# EAGLE design STM32F4Stick (EAGLE 6.6.0)
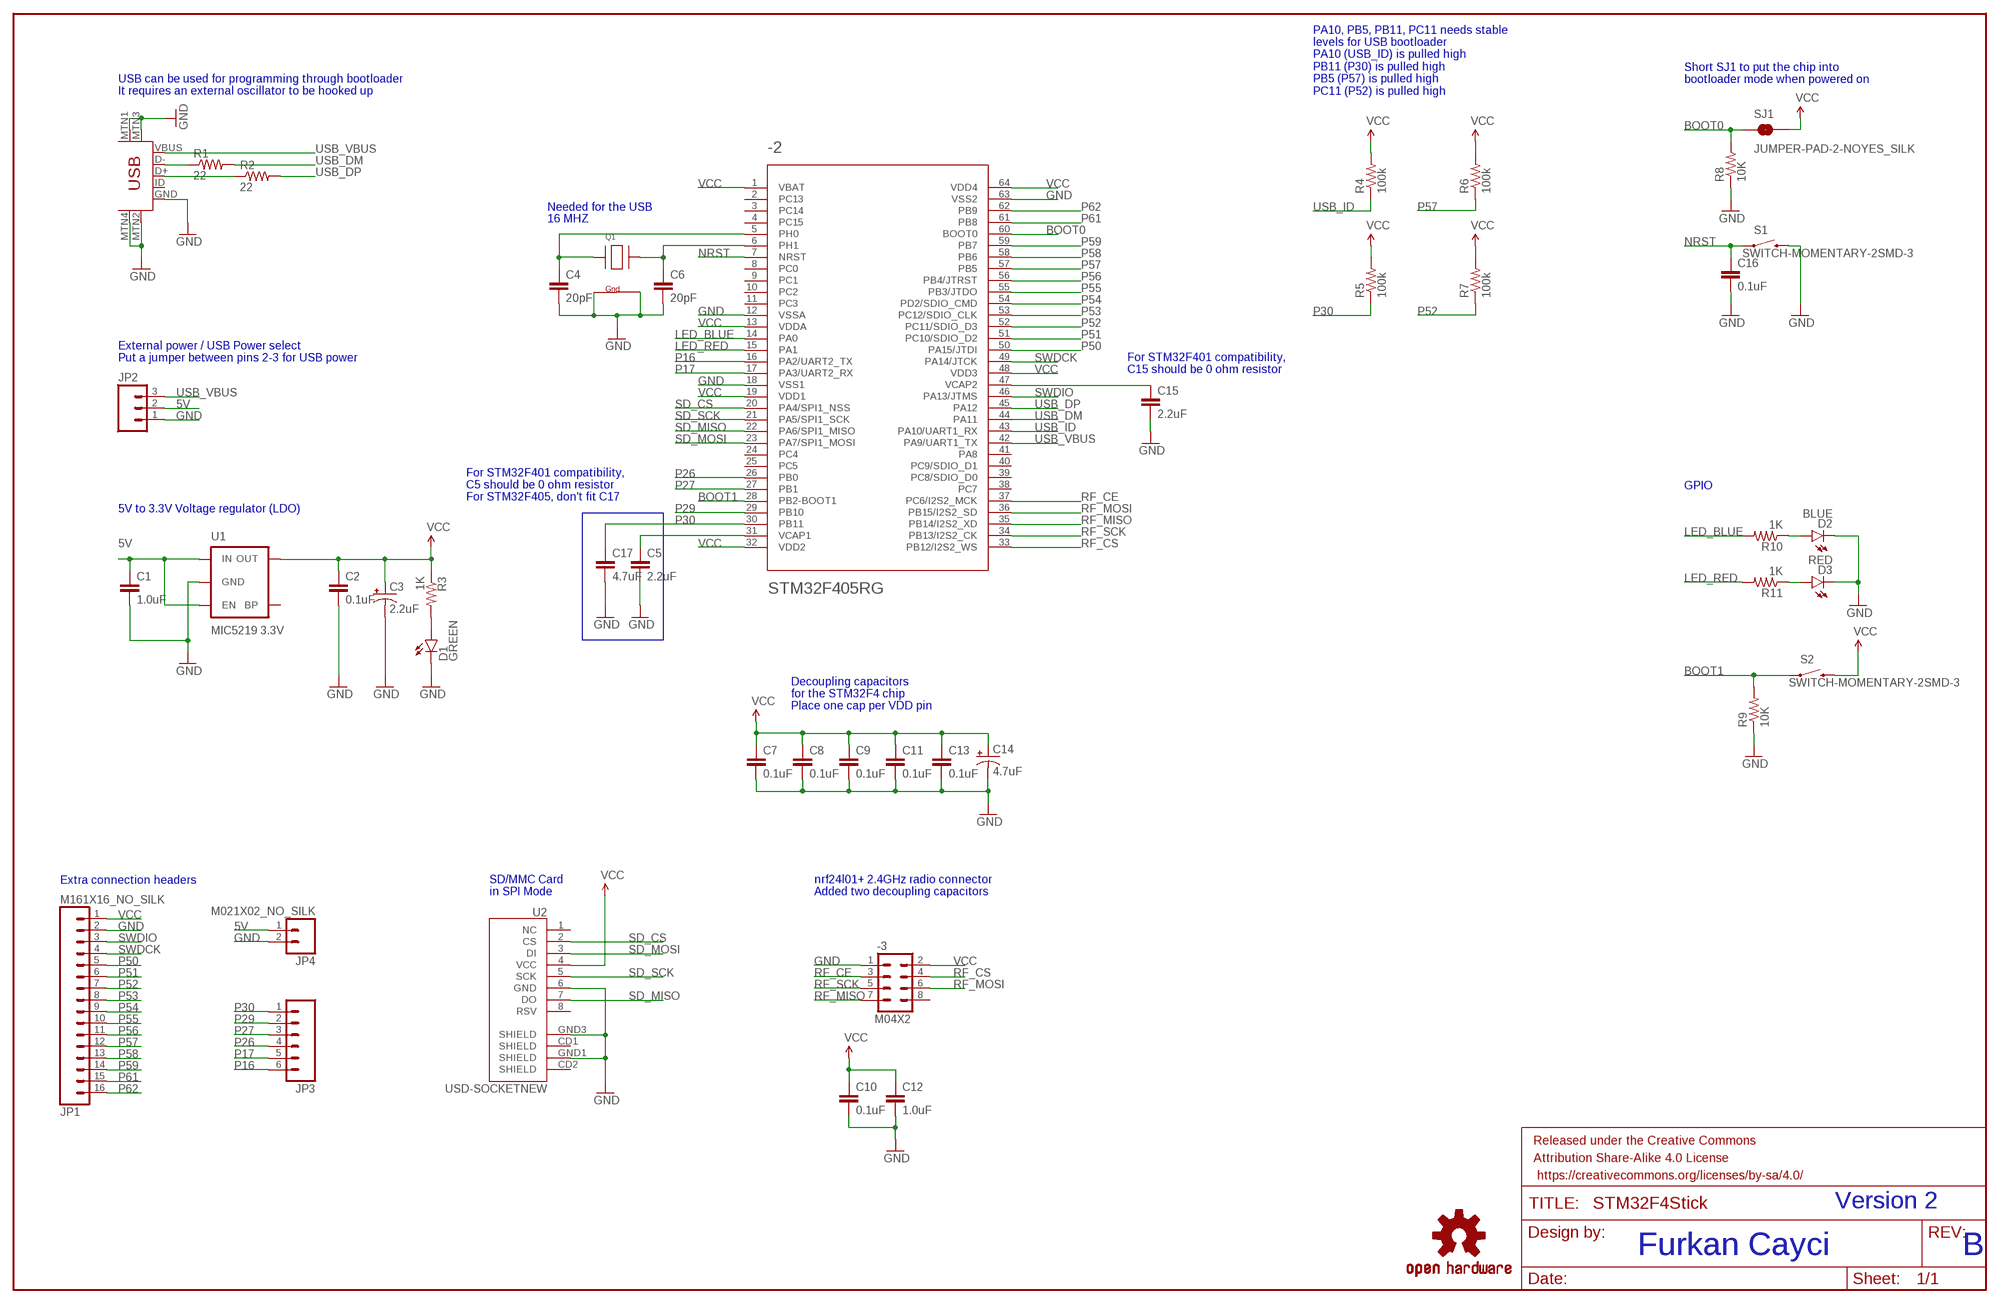
[diagram p0: schematic, sheet 1]

## Parts
-1  USB-MINIB-5PIN  [USB-MINIB]
-2  STM32F405RG  [TQFP64]
-3  M04X2  [2X4]
C1  1.0uF  1.0UF-16V-10%(0603)  [0603-CAP]
C2  0.1uF  0.1UF-25V-5%(0603)  [0603-CAP]
C3  2.2uF  CAP_POL1206  [EIA3216]
C4  20pF  12PF-50V-5%(0603)  [0603-CAP]
C5  2.2uF  2.2UF-10V-20%(0603)  [0603-CAP]
C6  20pF  12PF-50V-5%(0603)  [0603-CAP]
C7  0.1uF  0.1UF-25V-5%(0603)  [0603-CAP]
C8  0.1uF  0.1UF-25V-5%(0603)  [0603-CAP]
C9  0.1uF  0.1UF-25V-5%(0603)  [0603-CAP]
C10  0.1uF  0.1UF-25V-5%(0603)  [0603-CAP]
C11  0.1uF  0.1UF-25V-5%(0603)  [0603-CAP]
C12  1.0uF  1.0UF-16V-10%(0603)  [0603-CAP]
C13  0.1uF  0.1UF-25V-5%(0603)  [0603-CAP]
C14  4.7uF  CAP_POL1206  [EIA3216]
C15  2.2uF  2.2UF-10V-20%(0603)  [0603-CAP]
C16  0.1uF  0.1UF-25V-5%(0603)  [0603-CAP]
C17  4.7uF  4.7UF-6.3V-10%(0603)0603  [0603-CAP]
D1  GREEN  LED-GREEN0603  [LED-0603]
D2  BLUE  LED-BLUE0603  [LED-0603]
D3  RED  LED-RED0603  [LED-0603]
FRAME1  FRAME-LEDGER  [CREATIVE_COMMONS]
JP1  M161X16_NO_SILK  [1X16_NO_SILK]
JP2  M031X03_NO_SILK  [1X03_NO_SILK]
JP3  M06NO_SILK  [1X06_NO_SILK]
JP4  M021X02_NO_SILK  [1X02_NO_SILK]
LOGO1  OSHW-LOGOM  [OSHW-LOGO-M]
Q1  XTAL-4-3225  [NX3225]
R1  22  22OHM1/10W1%(0603)  [0603-RES]
R2  22  22OHM1/10W1%(0603)  [0603-RES]
R3  1K  1KOHM1/10W1%(0603)  [0603-RES]
R4  100k  100KOHM1/10W1%(0603)  [0603-RES]
R5  100k  100KOHM1/10W1%(0603)  [0603-RES]
R6  100k  100KOHM1/10W1%(0603)  [0603-RES]
R7  100k  100KOHM1/10W1%(0603)  [0603-RES]
R8  10K  10KOHM1/10W1%(0603)0603  [0603-RES]
R9  10K  10KOHM1/10W1%(0603)0603  [0603-RES]
R10  1K  1KOHM1/10W1%(0603)  [0603-RES]
R11  1K  1KOHM1/10W1%(0603)  [0603-RES]
S1  SWITCH-MOMENTARY-2SMD-3  [TACTILE_SWITCH_SMD-3]
S2  SWITCH-MOMENTARY-2SMD-3  [TACTILE_SWITCH_SMD-3]
SJ1  JUMPER-PAD-2-NOYES_SILK  [PAD-JUMPER-2-NO_YES_SILK]
U1  MIC5219 3.3V  V_REG_MIC52193.3V  [SOT23-5]
U2  USD-SOCKETNEW  [MICRO-SD-SOCKET-PP]

## Nets
5V: C1.1 JP2.2 JP4.1 U1.1(IN) U1.3(EN)
BOOT0: -2.60(BOOT0) R8.2 SJ1.1
BOOT1: -2.28(PB2-BOOT1) R9.2 S2.1
GND: -1.GND -1.MTN1(MTN2) -1.MTN2(MTN3) -1.MTN3(MTN1) -1.MTN4 -2.12(VSSA) -2.18(VSS1) -2.63(VSS2) -3.1 C1.2 C2.2 C3.C(-) C4.2 C5.2 C6.2 C7.2 C8.2 C9.2 C10.2 C11.2 C12.2 C13.2 C14.C(-) C15.2 C16.2 C17.2 D1.C D2.C D3.C JP1.2 JP2.1 JP4.2 Q1.2(G2) Q1.4(G1) R8.1 R9.1 S1.4 U1.2(GND) U2.6(GND) U2.GND1(SHIELD) U2.GND3(SHIELD)
LED_BLUE: -2.14(PA0) R10.2
LED_RED: -2.15(PA1) R11.2
N$1: -2.31(VCAP1) C5.1
N$3: -2.5(PH0) C4.1 Q1.1(X1)
N$4: -2.6(PH1) C6.1 Q1.3(X2)
N$10: -2.47(VCAP2) C15.1
N$18: D2.A R10.1
N$19: D3.A R11.1
N$35: D1.A R3.2
N$36: -1.D- R1.1
N$37: -1.D+ R2.1
NRST: -2.7(NRST) C16.1 S1.1
P16: -2.16(PA2/UART2_TX) JP3.6
P17: -2.17(PA3/UART2_RX) JP3.5
P26: -2.26(PB0) JP3.4
P27: -2.27(PB1) JP3.3
P29: -2.29(PB10) JP3.2
P30: -2.30(PB11) C17.1 JP3.1 R5.1
P50: -2.50(PA15/JTDI) JP1.5
P51: -2.51(PC10/SDIO_D2) JP1.6
P52: -2.52(PC11/SDIO_D3) JP1.7 R7.1
P53: -2.53(PC12/SDIO_CLK) JP1.8
P54: -2.54(PD2/SDIO_CMD) JP1.9
P55: -2.55(PB3/JTDO) JP1.10
P56: -2.56(PB4/JTRST) JP1.11
P57: -2.57(PB5) JP1.12 R6.1
P58: -2.58(PB6) JP1.13
P59: -2.59(PB7) JP1.14
P61: -2.61(PB8) JP1.15
P62: -2.62(PB9) JP1.16
RF_CE: -2.37(PC6/I2S2_MCK) -3.3
RF_CS: -2.33(PB12/I2S2_WS) -3.4
RF_MISO: -2.35(PB14/I2S2_XD) -3.7
RF_MOSI: -2.36(PB15/I2S2_SD) -3.6
RF_SCK: -2.34(PB13/I2S2_CK) -3.5
SD_CS: -2.20(PA4/SPI1_NSS) U2.2(CS)
SD_MISO: -2.22(PA6/SPI1_MISO) U2.7(DO)
SD_MOSI: -2.23(PA7/SPI1_MOSI) U2.3(DI)
SD_SCK: -2.21(PA5/SPI1_SCK) U2.5(SCK)
SWDCK: -2.49(PA14/JTCK) JP1.4
SWDIO: -2.46(PA13/JTMS) JP1.3
USB_DM: -2.44(PA11) R1.2
USB_DP: -2.45(PA12) R2.2
USB_ID: -2.43(PA10/UART1_RX) R4.1
USB_VBUS: -1.VBUS -2.42(PA9/UART1_TX) JP2.3
VCC: -2.1(VBAT) -2.13(VDDA) -2.19(VDD1) -2.32(VDD2) -2.48(VDD3) -2.64(VDD4) -3.2 C2.1 C3.A(+) C7.1 C8.1 C9.1 C10.1 C11.1 C12.1 C13.1 C14.A(+) JP1.1 R3.1 R4.2 R5.2 R6.2 R7.2 S2.4 SJ1.2 U1.5(OUT) U2.4(VCC)
Unconnected: -1.ID -2.2(PC13) -2.3(PC14) -2.4(PC15) -2.8(PC0) -2.9(PC1) -2.10(PC2) -2.11(PC3) -2.24(PC4) -2.25(PC5) -2.38(PC7) -2.39(PC8/SDIO_D0) -2.40(PC9/SDIO_D1) -2.41(PA8) -3.8 U1.4(BP) U2.1(NC) U2.8(RSV) U2.CD1(SHIELD) U2.CD2(SHIELD)

## Notes on the sheet
- Short SJ1 to put the chip into
  bootloader mode when powered on
- USB can be used for programming through bootloader
  It requires an external oscillator to be hooked up
- PA10, PB5, PB11, PC11 needs stable
  levels for USB bootloader
  PA10 (USB_ID) is pulled high
  PB11 (P30) is pulled high
  PB5 (P57) is pulled high
  PC11 (P52) is pulled high
- Needed for the USB
- 16 MHZ
- External power / USB Power select
  Put a jumper between pins 2-3 for USB power
- For STM32F401 compatibility,
  C15 should be 0 ohm resistor
- GPIO
- For STM32F401 compatibility,
  C5 should be 0 ohm resistor
  For STM32F405, don't fit C17
- 5V to 3.3V Voltage regulator (LDO)
- Decoupling capacitors
  for the STM32F4 chip
  Place one cap per VDD pin
- Extra connection headers
- SD/MMC Card
  in SPI Mode
- nrf24l01+ 2.4GHz radio connector
  Added two decoupling capacitors
- Version 2
- Furkan Cayci | B

## Library data of the parts
-1 = SparkFun-Connectors:USB-MINIB: Mini-USB "B" connector with 5th pin broken out. Created new symbol breaking out 5th "ID" pin in mini/micro USB connector spec. See: http://en.wikipedia.org/wiki/Mini_usb#Cables. Uses same footprint as 4-pin symbol. Also added pins to connect to mounting / shield pads if required (probably not generally needed as signals aren't shielded once they leave the connector).
-2 = SparkFun-DigitalIC:STM32F405RG: ARM DSP Chip used on the WAV Trigger board.
-3 = SparkFun-Connectors:M04X2: .1" header, two rows of four.
C1 C12 = SparkFun-Capacitors:1.0UF-16V-10%(0603): CAP-00868; PROD_ID: CAP-00868
C2 C7-C11 C13 C16 = SparkFun-Capacitors:0.1UF-25V-5%(0603): CAP-08604; PROD_ID: CAP-08604
C3 C14 = SparkFun-Capacitors:CAP_POL: Capacitor Polarized These are standard SMD and PTH capacitors. Normally 10uF, 47uF, and 100uF in electrolytic and tantalum varieties. Always verify the external diameter of the through hole cap, it varies with capacity, voltage, and manufacturer. The EIA devices should be standard.
C4 C6 = SparkFun-Capacitors:12PF-50V-5%(0603): CAP-09137; PROD_ID: CAP-09137; VALUE: 12pF
C5 C15 = SparkFun-Capacitors:2.2UF-10V-20%(0603): CAP-07888; PROD_ID: CAP-07888
C17 = SparkFun-Capacitors:4.7UF-6.3V-10%(0603): CAP-08280; PROD_ID: CAP-08280
D1 = SparkFun-LED:LED-GREEN: Various green LEDs Green LEDs used in SFE Production 0603- DIO-00821 LARGE- DIO-00862 LILYPAD- DIO-09910; PROD_ID: DIO-00821
D2 = SparkFun-LED:LED-BLUE: Blue LEDs for production use Various blue LEDs stocked by SparkFun production 0603 - DIO-08575 Rebel - DIO-09553 1206 - DIO-09911; PROD_ID: DIO-08575
D3 = SparkFun-LED:LED-RED: Assorted Red LEDs LilyPad 1206- DIO-09912 1206- DIO-00809 0603- DIO-00819; PROD_ID: DIO-00819
FRAME1 = SparkFun-Aesthetics:FRAME-LEDGER: Schematic Frame Standard 11x14 US Ledger frame
JP1 = SparkFun-Connectors:M16: 1x16 .1" header
JP2 = SparkFun-Connectors:M03: Header 3 Standard 3-pin 0.1" header. Use with straight break away headers (SKU : PRT-00116), right angle break away headers (PRT-00553), swiss pins (PRT-00743), machine pins (PRT-00117), and female headers (PRT-00115). Molex polarized connector foot print use with SKU : PRT-08232 with associated crimp pins and housings.
JP3 = SparkFun-Connectors:M06: Header 6 Standard 6-pin 0.1" header. Use with straight break away headers (SKU : PRT-00116), right angle break away headers (PRT-00553), swiss pins (PRT-00743), machine pins (PRT-00117), and female headers (PRT-00115). Molex polarized connector foot print use with SKU : PRT-08094 with associated crimp pins and housings. NOTES ON THE VARIANTS LOCK and LOCK_LONGPADS... This footprint was designed to help hold the alignment of a through-hole component (i.e. 6-pin header) while soldering it into place. You may notice that each hole has been shifted either up or down by 0.005 of an inch from it's more standard position (which is a perfectly straight line). This slight alteration caused the pins (the squares in the middle) to touch the edges of the holes. Because they are alternating, it causes a "brace" to hold the component in place. 0.005 has proven to be the perfect amount of "off-center" position when using our standard breakaway headers. Although looks a little odd when you look at the bare footprint, once you have a header in there, the alteration is very hard to notice. Also,if you push a header all the way into place, it is covered up entirely on the bottom side. This idea of altering the position of holes to aid alignment will be further integrated into the Sparkfun Library for other footprints. It can help hold any component with 3 or more connection pins.
JP4 = SparkFun-Connectors:M02: Standard 2-pin 0.1" header. Use with - straight break away headers ( PRT-00116) - right angle break away headers (PRT-00553) - swiss pins (PRT-00743) - machine pins (PRT-00117) - female headers (PRT-00115) Molex polarized connector foot print use with: PRT-08233 with associated crimp pins and housings. 2.54_SCREWTERM for use with PRT-10571. 3.5mm Screw Terminal footprints for PRT-08084 5mm Screw Terminal footprints for use with PRT-08433
LOGO1 = SparkFun-Aesthetics:OSHW-LOGO: Open Source Hardware Logo This logo indicates the piece of hardware it is found on incorporates a OSHW license and/or adheres to the definition of open source hardware found here: http://freedomdefined.org/OSHW
Q1 = adafruit:XTAL-4: Classic 4-pin 3.2 x 2.5mm crystal
R1 R2 = SparkFun-Resistors:22OHM1/10W1%(0603): RES-08698; PROD_ID: RES-08698
R3 R10 R11 = SparkFun-Resistors:1KOHM1/10W1%(0603): RES-07856; PROD_ID: RES-07856
R4-R7 = SparkFun-Resistors:100KOHM1/10W1%(0603): RES-07828; PROD_ID: RES-07828
R8 R9 = SparkFun-Resistors:10KOHM1/10W1%(0603): RES-00824; PROD_ID: RES-00824
S1 S2 = SparkFun-Electromechanical:SWITCH-MOMENTARY-2: Various NO switches- pushbuttons, reed, etc
SJ1 = SparkFun-Passives:JUMPER-PAD-2-NO
U1 = SparkFun-PowerIC:V_REG_MIC5219: V_REG MIC5219 Standard 3.3V and 5V 500mA LDO voltage regulator in SOT-23 layout. Micrel part MIC5219. BP (by-pass) pin is used to lower output noise with 470pF cap, may be left open.; PROD_ID: VREG-09872
U2 = SparkFun-Connectors:USD-SOCKET: microSD Socket Push-push type uSD socket. Schematic element and footprint production proven. Spark Fun Electronics SKU : PRT-00127. tDoc lines correctly indicate media card edge positions when inserting (unlocked, locked, depressed).

## Net classes
0 default: width 0.203 mm

## Board
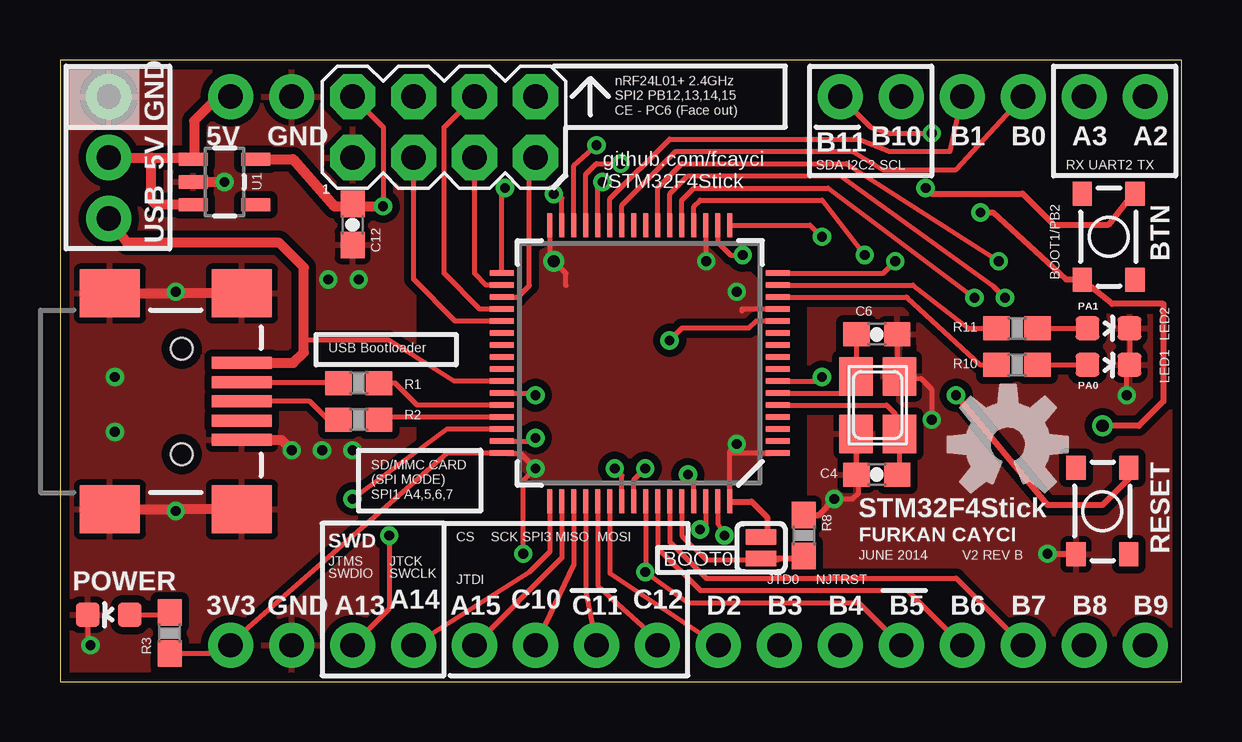
[diagram p1: board, top side]
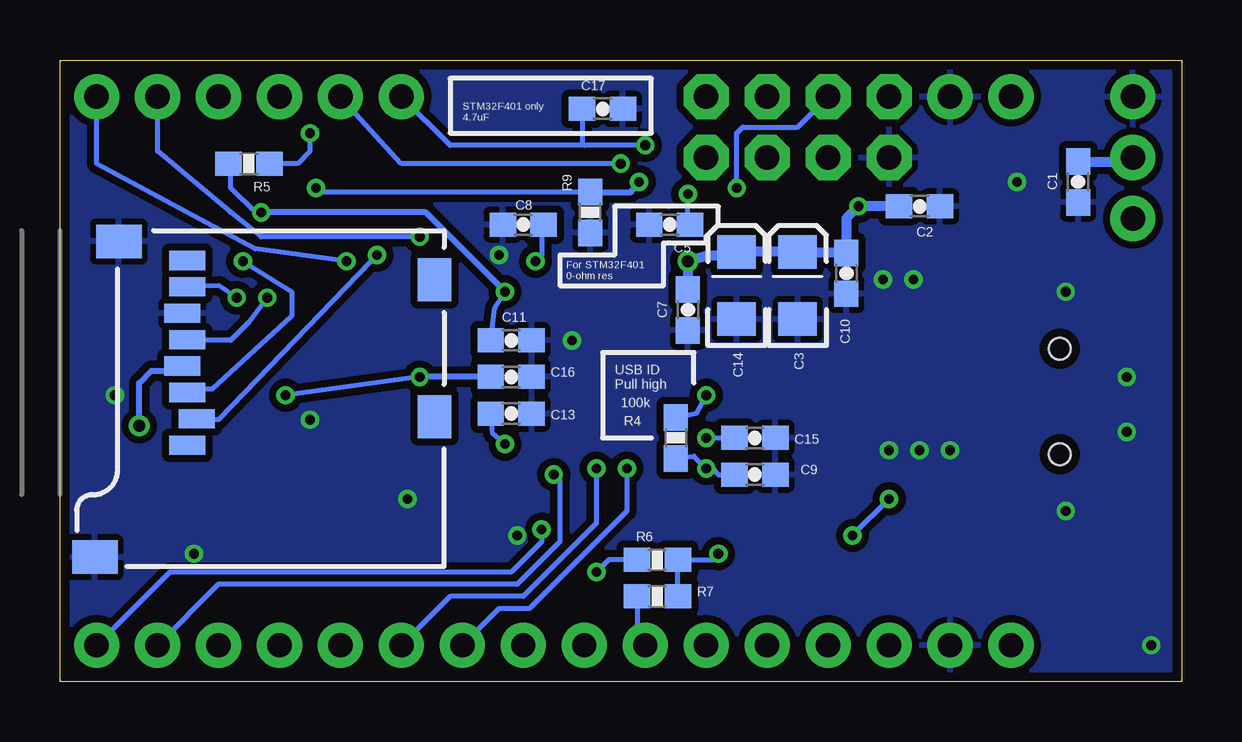
[diagram p2: board, bottom side, seen from below]

Size 46.74 x 25.91 mm. Coordinates in mm from the lower left corner, seen from the top.
Outline: 0,0 46.74,0 46.74,25.91 0,25.91 0,0
Copper layers (1*16): Top 0.0356mm / dielectric 1.5011mm / Bottom 0.0356mm
Design rules "LaenPCBOrder": minimum track width 6mil, minimum drill 13mil, track to track 6mil, track to pad 6mil, pad to pad 6mil, via to via 6mil, smd to smd 6mil, copper to edge 15mil, drill to drill 6mil, minimum pad ring 7mil, minimum via ring 7mil, stop-mask expansion 3mil, vias tented up to drill 0mil, thermal gap 10mil

### Footprints (pad centres in the part's own frame; a part is rotated, then mirrored left to right if it is on the bottom)
USB-MINIB = smd 2.5 x 0.5: D+ 2.5,0; D- 2.5,0.8; GND 2.5,-1.6; ID 2.5,-0.8; VBUS 2.5,1.6 | smd 2.5 x 2: MTN1 -3,4.5; MTN2 2.5,4.5; MTN3 -3,-4.5; MTN4 2.5,-4.5 | hole 0.9: 0,2.2; 0,-2.2
TQFP64 = smd 0.22 x 1: 1 -3.75,-5.75; 2 -3.25,-5.75; 3 -2.75,-5.75; 4 -2.25,-5.75; 5 -1.75,-5.75; 6 -1.25,-5.75; 7 -0.75,-5.75; 8 -0.25,-5.75; 9 0.25,-5.75; 10 0.75,-5.75; 11 1.25,-5.75; 12 1.75,-5.75; 13 2.25,-5.75; 14 2.75,-5.75; 15 3.25,-5.75; 16 3.75,-5.75; 33 3.75,5.75; 34 3.25,5.75; 35 2.75,5.75; 36 2.25,5.75; 37 1.75,5.75; 38 1.25,5.75; 39 0.75,5.75; 40 0.25,5.75; 41 -0.25,5.75; 42 -0.75,5.75; 43 -1.25,5.75; 44 -1.75,5.75; 45 -2.25,5.75; 46 -2.75,5.75; 47 -3.25,5.75; 48 -3.75,5.75 | smd 1 x 0.22: 17 5.75,-3.75; 18 5.75,-3.25; 19 5.75,-2.75; 20 5.75,-2.25; 21 5.75,-1.75; 22 5.75,-1.25; 23 5.75,-0.75; 24 5.75,-0.25; 25 5.75,0.25; 26 5.75,0.75; 27 5.75,1.25; 28 5.75,1.75; 29 5.75,2.25; 30 5.75,2.75; 31 5.75,3.25; 32 5.75,3.75; 49 -5.75,3.75; 50 -5.75,3.25; 51 -5.75,2.75; 52 -5.75,2.25; 53 -5.75,1.75; 54 -5.75,1.25; 55 -5.75,0.75; 56 -5.75,0.25; 57 -5.75,-0.25; 58 -5.75,-0.75; 59 -5.75,-1.25; 60 -5.75,-1.75; 61 -5.75,-2.25; 62 -5.75,-2.75; 63 -5.75,-3.25; 64 -5.75,-3.75
2X4 = drill 1.016 pad 1.88 octagon: 1 -3.81,-1.27; 2 -3.81,1.27; 3 -1.27,-1.27; 4 -1.27,1.27; 5 1.27,-1.27; 6 1.27,1.27; 7 3.81,-1.27; 8 3.81,1.27
0603-CAP = smd 1.1 x 1: 1 -0.85,0; 2 0.85,0
EIA3216 = smd 1.4 x 1.6: A 1.4,0; C -1.4,0
LED-0603 = smd 1 x 1: A 0,-0.877; C 0,0.877
1X16_NO_SILK = drill 1.016 pad 1.88: 1 0,0; 2 2.54,0; 3 5.08,0; 4 7.62,0; 5 10.16,0; 6 12.7,0; 7 15.24,0; 8 17.78,0; 9 20.32,0; 10 22.86,0; 11 25.4,0; 12 27.94,0; 13 30.48,0; 14 33.02,0; 15 35.56,0; 16 38.1,0
1X03_NO_SILK = drill 1.016 pad 1.88: 1 0,0; 2 2.54,0; 3 5.08,0
1X06_NO_SILK = drill 1.016 pad 1.88: 1 0,0; 2 2.54,0; 3 5.08,0; 4 7.62,0; 5 10.16,0; 6 12.7,0
1X02_NO_SILK = drill 1.016 pad 1.88: 1 0,0; 2 2.54,0
NX3225 = smd 1.6 x 1.4: 1 -1.2,-0.9; 2 1.2,-0.9; 3 1.2,0.9; 4 -1.2,0.9
0603-RES = smd 1.1 x 1: 1 -0.85,0; 2 0.85,0
TACTILE_SWITCH_SMD-3 = smd 1 x 0.8: 1 -1.8,1.1; 2 1.8,1.1; 3 -1.8,-1.1; 4 1.8,-1.1
PAD-JUMPER-2-NO_YES_SILK = smd 0.635 x 1.27: 1 -0.45,0; 2 0.45,0
SOT23-5 = smd 0.55 x 1.2: 1 -0.95,-1.3; 2 0,-1.3; 3 0.95,-1.3; 4 0.95,1.3; 5 -0.95,1.3
MICRO-SD-SOCKET-PP = smd 0.8 x 1.5: 1 -8.94,10.7; 2 -7.84,10.3; 3 -6.74,10.7; 4 -5.64,10.9; 5 -4.54,10.7; 6 -3.44,10.9; 7 -2.34,10.7; 8 -1.24,10.7 | smd 1.8 x 1.4: CD1 -2.05,0.4; CD2 -7.75,0.4 | smd 1.4 x 1.9: GND1 -13.6,14.55; GND3 -0.45,13.55

### Placement (x,y rotation side)
-1  5.08,11.68 0 top
-2  24.16,13.28 90 top
-3  16,23.11 0 top
C1  4.32,20.83 270 bottom
C2  10.92,19.81 0 bottom
C3  16,16.51 90 bottom
C4  34.04,8.64 180 top
C5  21.34,19.05 180 bottom
C6  34.04,14.48 0 top
C7  20.57,15.49 270 bottom
C8  27.43,19.05 180 bottom
C9  17.78,8.64 0 bottom
C10  13.97,17.02 270 bottom
C11  27.94,14.22 0 bottom
C12  12.19,19.05 270 top
C13  27.94,11.18 0 bottom
C14  18.54,16.51 90 bottom
C15  17.78,10.16 0 bottom
C16  27.94,12.7 0 bottom
C17  24.13,23.88 0 bottom
D1  2.03,2.79 90 top
D2  43.69,13.21 270 top
D3  43.69,14.73 270 top
FRAME1  -5.59,-9.14 0 top  (outside the outline)
JP1  7.11,1.52 0 top
JP2  2.03,24.38 270 top
JP3  32.51,24.38 0 top
JP4  7.11,24.38 0 top
LOGO1  39.5,9.88 0 top
Q1  34.07,11.53 90 top
R1  12.45,12.45 0 top
R2  12.45,10.92 0 top
R3  4.57,2.03 90 top
R4  21.08,10.16 270 bottom
R5  38.86,21.59 180 bottom
R6  21.84,5.08 0 bottom
R7  21.84,3.56 0 bottom
R8  30.99,6.1 270 top
R9  24.64,19.56 90 bottom
R10  39.88,13.21 180 top
R11  39.88,14.73 180 top
S1  43.43,7.11 270 top
S2  43.69,18.54 270 top
SJ1  29.21,5.59 90 top
U1  6.86,20.83 270 top
U2  30.73,18.8 90 bottom

### Tracks (layer width: path | path; a pad name or v marks a point on that pad's centre or on a via)
5V
  Top 0.406: JP2.2 3.81,21.84 | 3.81,21.84 5.49,21.84 U1.1 5.59,21.81 5.59,23.37 6.6,24.38 JP4.1 | U1.3 4,19.88 3.81,20.07 3.81,21.84
  Bottom 0.406: C1.1 2.2,21.68 JP2.2
BOOT0
  Top 0.203: -2.60 25.91,6.09 26.92,5.08 29.91,5.08 29.97,5.14
  Top 0.254: SJ1.1 29.97,5.14 30.88,5.14 R8.2
BOOT1  (via drill 0.41)
  Top 0.203: -2.28 22.41,20.63 v22.61,20.83 | 36.3,20.34 v36.07,20.57
  Top 0.254: 36.3,20.34 40.11,20.34 41.4,19.05 43.69,19.05 44.7,20.32 44.7,20.26 S2.1
  Bottom 0.203: R9.2 35.9,20.41
  Bottom 0.254: R9.2 22.95,20.41 v22.61,20.83 | 35.9,20.41 v36.07,20.57
GND  (via drill 0.41)
  Top 0.203: D1.C 1.16,1.64 v1.27,1.52 | -2.63 27.41,6.58 v27.69,6.1 | -2.18 27.41,18.31 27.94,17.78 v28.45,17.78 | v25.4,14.22 25.91,14.73 28.7,14.73 29,15.03 -2.12 | 44.7,14.87 D3.C D2.C 44.45,12.84 v44.45,11.94 | 42.31,5.33 S1.4 42.36,5.33 | C6.2 34.89,12.64 Q1.2 35.89,12.63 36.32,12.19 v36.32,10.92 | v32.26,7.62 33.02,7.62 33.27,7.87 33.27,8.55 C4.2 | 33.27,8.72 C4.2 | Q1.4 33.17,8.65 C4.2
  Top 0.254: R8.1 31.58,6.95 v32.26,7.62 | v41.15,5.33 42.33,5.33 S1.4
  Top 0.406: -1.GND 9.22,10.08 v9.65,9.65 | -1.MTN4 4.75,7.18 | 4.75,7.18 4.64,7.18 | 4.64,7.18 v4.83,7.11 4.75,7.18 | -1.MTN1 4.5,16.18 v4.83,16.26 5.15,16.18 -1.MTN2 | U1.2 v6.86,20.83 | -1.MTN3 4.64,7.18
  other vias: 2.29,12.7 2.29,10.41 10.92,9.65 12.19,9.65 12.45,16.76 11.18,16.76
  pour Bottom (isolate 0.305): 0,25.65 46.74,25.65 46.74,0 0,0
  pour Top (isolate 0.305): 0,25.91 14.73,25.91 14.73,0 0,0
  pour Top (isolate 0.305): 31.24,16 46.74,16 46.74,0 31.24,0
LED_BLUE
  Top 0.203: -2.14 35.28,16.03 35.31,16 38.35,13.21 R10.2
LED_RED
  Top 0.203: -2.15 35.54,16.53 37.85,14.73 R11.2
N$1  (via drill 0.41)
  Top 0.203: -2.31 20.91,20.15 v20.57,20.32
  Bottom 0.203: C5.1 20.57,19.22 v20.57,20.32
N$3
  Top 0.203: -2.5 34.44,11.53 34.8,11.18 34.8,10.5 Q1.1 34.97,8.72 C4.1 34.87,8.65
N$4
  Top 0.203: -2.6 32.68,12.03 Q1.3 33.19,12.71 C6.1
N$10  (via drill 0.41)
  Top 0.203: -2.47 19.68,10.03 v19.81,10.16
  Bottom 0.203: v19.81,10.16 C15.1
N$18
  Top 0.203: R10.1 D2.A
N$19
  Top 0.203: R11.1 D3.A
N$35
  Top 0.203: D1.A 4.48,2.79 R3.2
N$36
  Top 0.203: -1.D- 11.6,12.48 R1.1
N$37
  Top 0.203: R2.1 11.18,10.92 10.41,11.68 -1.D+
NRST  (via drill 0.41)
  Top 0.203: -2.7 31.58,12.53 v31.75,12.7
  Top 0.254: S1.1 44.53,8.47 43.43,7.37 41.15,7.37 v37.34,11.94
  Bottom 0.203: v31.75,12.7 v37.34,11.94
  Bottom 0.254: C16.1 v31.75,12.7
P16  (via drill 0.41)
  Top 0.203: -2.16 34.3,17.03 v34.8,17.53
  Bottom 0.203: v34.8,17.53 38.61,18.03 45.21,21.59 JP3.6
P17  (via drill 0.41)
  Top 0.203: -2.17 31.26,19.03 v31.75,18.54
  Bottom 0.203: v31.75,18.54 38.35,18.54 39.62,19.56 42.67,22.1 JP3.5
P26
  Top 0.203: -2.26 23.41,19.86 25.65,22.1 33.02,22.1 34.29,21.34 37.34,21.34 JP3.4
P27
  Top 0.203: -2.27 22.91,20.12 25.4,22.61 33.27,22.61 34.54,22.1 37.08,22.1 JP3.3
P29  (via drill 0.41)
  Top 0.203: -2.29 21.91,21.15 22.35,21.59 v23.37,21.59
  Bottom 0.203: v23.37,21.59 32.51,21.59 JP3.2
P30  (via drill 0.41)
  Top 0.203: -2.30 21.41,21.52 v22.35,22.35 | JP3.1 33.78,23.11 34.54,22.86 v36.32,22.86
  Bottom 0.203: v22.35,22.35 24.89,22.35 | 24.89,22.35 30.48,22.35 JP3.1 | v36.32,22.86 36.32,22.1 36.83,21.59 R5.1 | C17.1 24.98,22.44 24.89,22.35
P50
  Top 0.203: -2.50 20.91,5.16 JP1.5
P51
  Top 0.203: -2.51 21.41,4.9 JP1.6
P52
  Top 0.203: -2.52 21.91,3.74 JP1.7
  Bottom 0.203: R7.1 22.69,1.87 JP1.7
P53
  Top 0.203: -2.53 22.41,4 24.89,1.78 JP1.8
P54
  Top 0.203: -2.54 22.91,4.52 JP1.9
P55  (via drill 0.41)
  Top 0.203: -2.55 23.41,8.59 v23.11,8.89
  Bottom 0.203: v23.11,8.89 23.11,7.11 27.18,3.05 28.45,3.05 JP1.10
P56  (via drill 0.41)
  Top 0.203: -2.56 23.91,8.42 v24.38,8.89
  Bottom 0.203: v24.38,8.89 24.38,6.6 27.43,3.56 30.48,3.56 JP1.11
P57  (via drill 0.41)
  Top 0.203: JP1.12 33.27,3.3 26.16,3.3 v24.38,4.57 24.41,4.6 -2.57
  Bottom 0.203: R6.1 23.88,5.08 v24.38,4.57
P58
  Top 0.203: -2.58 24.91,5.57 26.67,3.81 35.31,3.81 JP1.13
P59
  Top 0.203: -2.59 25.41,5.83 26.92,4.32 37.34,4.32 JP1.14
P61  (via drill 0.41)
  Top 0.203: -2.61 26.41,8.39 v26.16,8.64
  Bottom 0.203: v26.16,8.64 25.91,8.38 25.91,5.84 27.69,4.06 40.13,4.06 JP1.15
P62  (via drill 0.41)
  Top 0.203: -2.62 26.91,6.59 v26.67,6.35
  Bottom 0.203: v26.67,6.35 26.67,5.84 27.94,4.57 42.16,4.57 JP1.16
RF_CE
  Top 0.203: -2.37 16.46,15.03 14.73,16.76 -3.3
RF_CS  (via drill 0.41)
  Top 0.203: -2.33 18.41,20.44 v18.54,20.57
  Bottom 0.203: v18.54,20.57 18.54,22.86 18.29,23.11 16,23.11 -3.4
RF_MISO
  Top 0.203: -2.35 19.08,16.03 19.56,16.51 19.56,21.59 -3.7
RF_MOSI
  Top 0.203: -2.36 17.49,15.53 16,17.02 16,23.11 -3.6
RF_SCK
  Top 0.203: -2.34 17.76,16.53 17.27,17.02 -3.5
SD_CS  (via drill 0.41)
  Top 0.203: -2.20 26.41,19.81 26.67,20.07 31.75,20.07 v33.53,17.78
  Bottom 0.203: v33.53,17.78 33.78,17.53 40.13,10.92 40.75,10.92 U2.2
SD_MISO  (via drill 0.41)
  Top 0.203: -2.22 25.41,20.33 26.16,21.08 32.51,21.08 38.86,16.51 v39.37,16
  Bottom 0.203: v39.37,16 40.11,16.51 U2.7
SD_MOSI  (via drill 0.41)
  Top 0.203: -2.23 24.91,20.59 25.91,21.59 32.77,21.59 v39.12,17.53
  Bottom 0.203: v39.12,17.53 37.08,16.26 37.08,15.24 40.39,12.19 41.3,12.19 U2.3
SD_SCK  (via drill 0.41)
  Top 0.203: -2.21 25.91,20.07 26.42,20.57 32,20.57 v38.1,16
  Bottom 0.203: v38.1,16 38.86,14.99 39.62,14.22 41.4,14.22 U2.5
SWDCK
  Top 0.203: -2.49 20.41,5.42 19.56,4.57 JP1.4
SWDIO  (via drill 0.41)
  Top 0.203: -2.46 16.12,10.53 v12.19,7.62 | v13.72,6.1 13.72,3.05 JP1.3
  Bottom 0.203: v12.19,7.62 v13.72,6.1
USB_DM
  Top 0.203: -2.44 14.88,11.53 13.97,12.45 R1.2
USB_DP
  Top 0.203: -2.45 13.41,11.03 R2.2
USB_ID  (via drill 0.41)
  Top 0.203: -2.43 19.72,12.03 v19.81,11.94
  Bottom 0.203: v19.81,11.94 20.23,11.18 R4.1
USB_VBUS
  Top 0.203: 10.16,14.22 13.72,14.22 16.42,12.53 -2.42
  Top 0.406: -1.VBUS 9.73,13.28 10.16,13.72 10.16,14.22 10.16,17.27 9.14,18.29 2.79,18.29 JP2.3
VCC  (via drill 0.41, 0.51)
  Top 0.203: -2.32 20.41,17.87 v20.57,17.53 21.08,17.02 21.08,16.51 | 27.94,7.5 -2.64 27.91,9.62 v28.19,9.91 28.33,9.53 | -2.1 28.33,9.53 | -2.13 28.41,15.53 28.41,15.46 | v26.92,17.53 26.92,19.02 -2.19 | 28.33,9.53 28.06,9.53 | 6.65,1.22 16.14,9.53 -2.48 19.17,9.53 v19.81,8.89 19.3,8.38 v19.3,5.33 | 6.65,1.22 6.6,1.18 R3.1 | JP1.1 6.95,1.52 6.65,1.22 | -3.2 13.46,23.11 v13.46,19.81
  Top 0.254: 27.94,7.5 28.82,7.5 29.46,6.86 29.46,6.29 SJ1.2 | v38.35,19.56 38.86,19.56 41.91,16.76 42.57,16.76 S2.4 | v43.43,10.67 44.96,10.67 45.97,11.68 45.97,15.75 43.84,15.75 S2.4 | S2.4 42.44,16.74 42.42,16.76
  Top 0.406: U1.5 9.72,21.78 11.43,19.81 12.1,19.81 | 12.1,19.81 C12.1 | 12.1,19.81 v13.46,19.81
  Bottom 0.203: C8.1 26.67,18.88 26.67,17.78 v26.92,17.53 | v28.19,9.91 28.7,10.33 C13.1 | C9.1 19.3,8.64 19.56,8.89 v19.81,8.89 20.32,9.4 R4.2 | C11.1 28.61,15.58 v28.19,16.26 | v38.35,19.56 38.61,19.56 39.62,20.57 39.62,21.5 R5.2 | R7.2 R6.2 19.56,5.08 v19.3,5.33
  Bottom 0.254: v28.19,16.26 31.5,19.56 v38.35,19.56 | v43.43,10.67 43.43,12.45 42.93,12.95 41.84,12.95 U2.4
  Bottom 0.406: C7.1 v20.57,17.53 19.69,17.78 18.67,17.78 C14.A C3.A 15.96,17.87 C10.1 13.97,19.3 v13.46,19.81 C2.1 | C7.1 20.57,16.26 20.74,16.26 C7.1
  pour Top (isolate 0.305): 19.05,17.27 19.3,17.53 20.83,18.29 27.43,18.29 29.97,15.75 29.97,9.91 27.43,7.37 20.83,7.37 18.54,9.65 18.8,12.19 19.05,12.19

### Text on the board
tPlace: nRF24L01+ 2.4GHz / SPI2 PB12,13,14,15 / CE - PC6 (Face out) | GND | 5V | GND | B11 | B10 | B1 | B0 | A3 | A2 | 5V | github.com/fcayci / /STM32F4Stick | SDA I2C2 SCL | RX UART2 TX | 1 | USB | BTN | BOOT1/PB2 | PA1 | USB Bootloader | LED2 | PA0 | LED1 | SD/MMC CARD / (SPI MODE) / SPI1 A4,5,6,7 | STM32F4Stick | SWD | CS SCK SPI3 MISO MOSI | FURKAN CAYCI | JTMS | JTCK | BOOT0 | JUNE 2014 | V2 REV B | RESET | POWER | SWDIO | SWCLK | JTDI | JTD0 | NJTRST | 3V3 | GND | A13 | A14 | A15 | C10 | C11 | C12 | D2 | B3 | B4 | B5 | B6 | B7 | B8 | B9
bPlace: STM32F401 only / 4.7uF | For STM32F401 / 0-ohm res | USB ID / Pull high | 100k